# EAGLE schematic timerinsol (EAGLE 6.5.0)
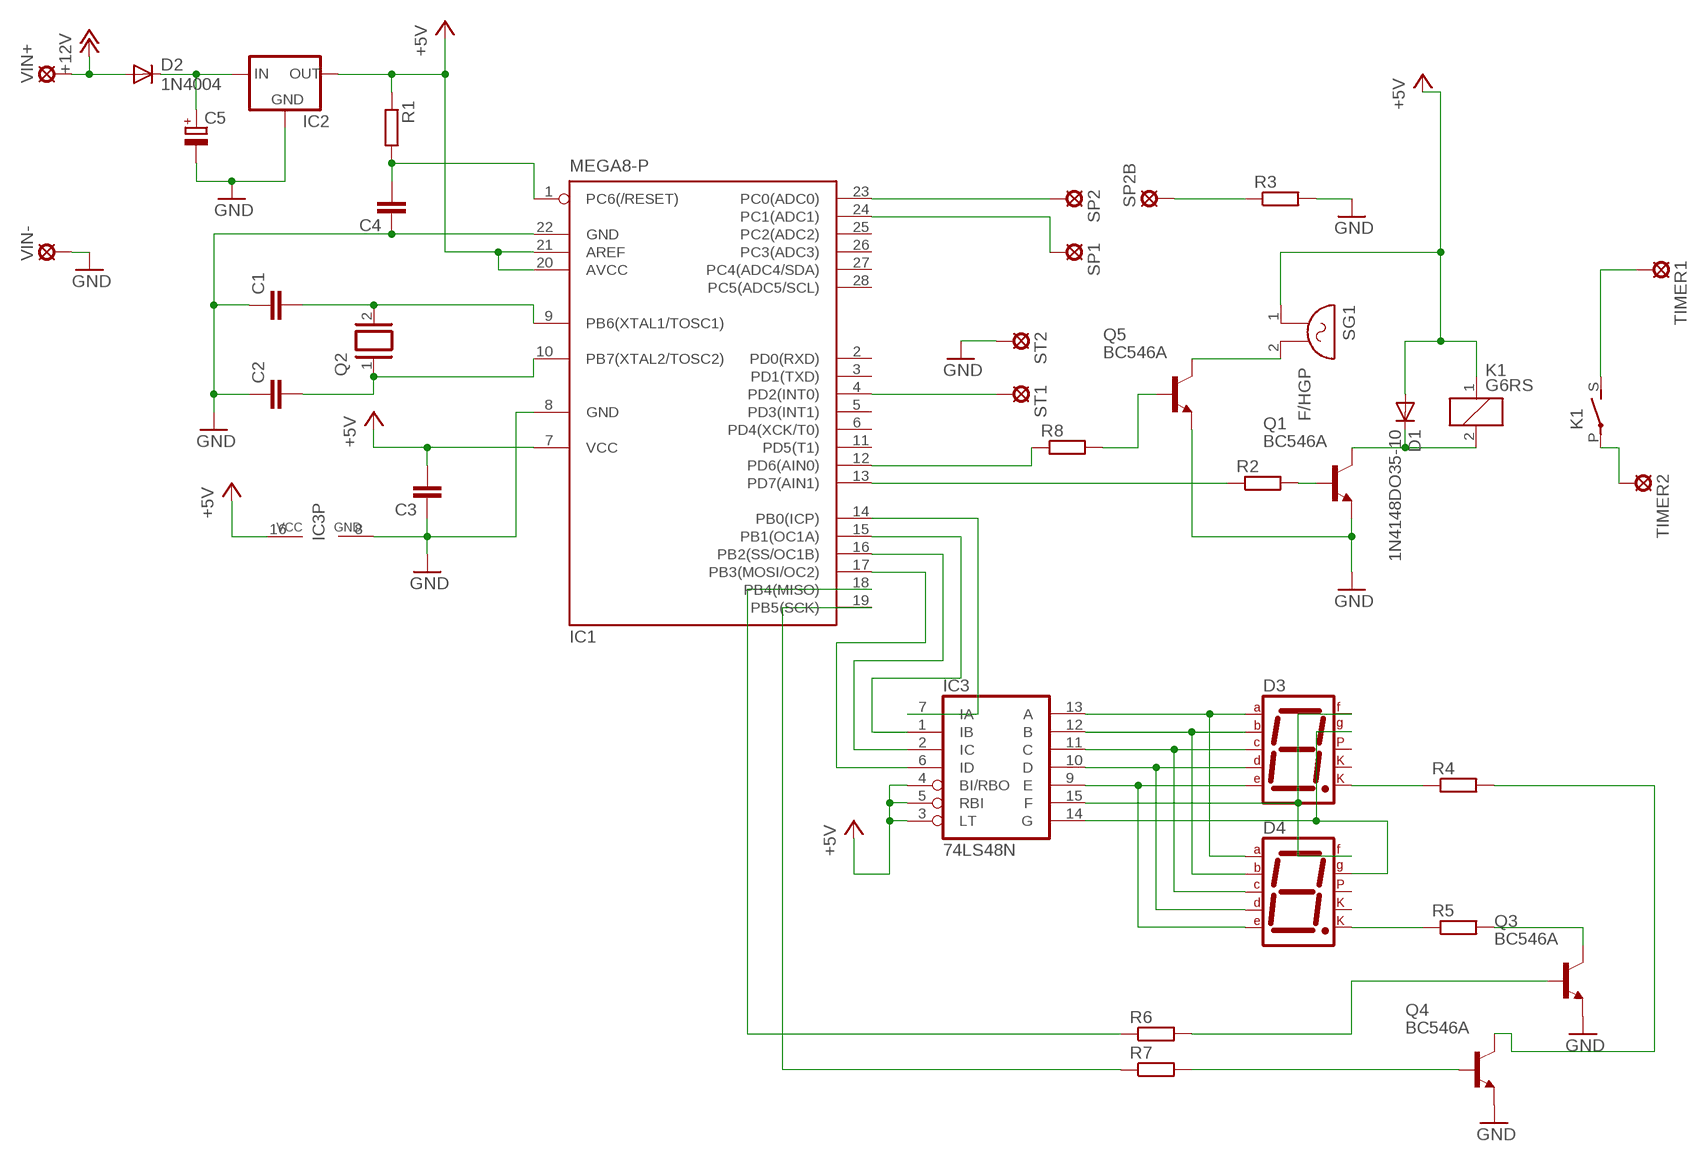
[diagram p0: schematic, sheet 1]

## Parts
C1  C-EU025-025X050  [C025-025X050]
C2  C-EU025-025X050  [C025-025X050]
C3  C-EU025-025X050  [C025-025X050]
C4  C-EU025-025X050  [C025-025X050]
C5  CPOL-EUE2.5-6  [E2,5-6]
D1  1N4148DO35-10  [DO35-10]
D2  1N4004  [DO41-10]
D3  7SEG-CK  [7SEG-13]
D4  7SEG-CK  [7SEG-13]
IC1  MEGA8-P  [DIL28-3]
IC2  78XXS  [78XXS]
IC3  74LS48N  [DIL16]
K1  G6RS  [G6RS]
Q1  BC546A  [TO92-EBC]
Q2  XTAL/S  [QS]
Q3  BC546A  [TO92-EBC]
Q4  BC546A  [TO92-EBC]
Q5  BC546A  [TO92-EBC]
R1  R-EU_0204/7  [0204/7]
R2  R-EU_0207/5V  [0207/5V]
R3  R-EU_0207/5V  [0207/5V]
R4  R-EU_0207/5V  [0207/5V]
R5  R-EU_0207/5V  [0207/5V]
R6  R-EU_0207/5V  [0207/5V]
R7  R-EU_0207/5V  [0207/5V]
R8  R-EU_0207/5V  [0207/5V]
SG1  F/HGP  [F/HGP]
SP1  LSP10  [LSP10]
SP2  LSP10  [LSP10]
SP2B  LSP10  [LSP10]
ST1  LSP10  [LSP10]
ST2  LSP10  [LSP10]
TIMER1  LSP10  [LSP10]
TIMER2  LSP10  [LSP10]
VIN+  LSP10  [LSP10]
VIN-  LSP10  [LSP10]

## Nets
+5V: C3.2 D1.A IC1.7(VCC) IC1.20(AVCC) IC1.21(AREF) IC2.OUT IC3.3(LT) IC3.4(BI/RBO) IC3.5(RBI) IC3.16(VCC) K1.1 R1.1 SG1.1
+12V: D2.A VIN+.MP
GND: C1.1 C2.1 C3.1 C4.1 C5.- IC1.8(GND) IC1.22(GND) IC2.GND IC3.8(GND) Q1.E Q3.E Q4.E Q5.E R3.2 ST2.MP VIN-.MP
N$1: D3.7(A) D4.7(A) IC3.13(A)
N$2: D3.6(B) D4.6(B) IC3.12(B)
N$3: D3.4(C) D4.4(C) IC3.11(C)
N$4: D3.2(D) D4.2(D) IC3.10(D)
N$5: D3.1(E) D4.1(E) IC3.9(E)
N$6: D3.9(F) D4.9(F) IC3.15(F)
N$7: IC1.13(PD7(AIN1)) R2.1
N$8: Q1.B R2.2
N$9: D1.C K1.2 Q1.C
N$10: D3.10(G) D4.10(G) IC3.14(G)
N$11: C1.2 IC1.9(PB6(XTAL1/TOSC1)) Q2.2
N$12: C2.2 IC1.10(PB7(XTAL2/TOSC2)) Q2.1
N$13: IC1.4(PD2(INT0)) ST1.MP
N$14: IC1.14(PB0(ICP)) IC3.7(IA)
N$15: IC1.15(PB1(OC1A)) IC3.1(IB)
N$16: C4.2 IC1.1(PC6(/RESET)) R1.2
N$17: IC1.16(PB2(SS/OC1B)) IC3.2(IC)
N$18: C5.+ D2.C IC2.IN
N$19: IC1.17(PB3(MOSI/OC2)) IC3.6(ID)
N$20: IC1.23(PC0(ADC0)) SP2.MP
N$21: Q4.B R7.2
N$22: IC1.18(PB4(MISO)) R6.1
N$23: IC1.19(PB5(SCK)) R7.1
N$24: Q3.B R6.2
N$25: D4.8(CK2) R5.1
N$26: Q3.C R5.2
N$27: D3.8(CK2) R4.1
N$28: Q4.C R4.2
N$29: IC1.12(PD6(AIN0)) R8.1
N$30: K1.S(2:S) TIMER1.MP
N$31: K1.P(2:P) TIMER2.MP
N$32: Q5.B R8.2
N$33: IC1.24(PC1(ADC1)) SP1.MP
N$34: Q5.C SG1.2
N$35: R3.1 SP2B.MP
Unconnected: D3.3(CK1) D3.5(DP) D4.3(CK1) D4.5(DP) IC1.2(PD0(RXD)) IC1.3(PD1(TXD)) IC1.5(PD3(INT1)) IC1.6(PD4(XCK/T0)) IC1.11(PD5(T1)) IC1.25(PC2(ADC2)) IC1.26(PC3(ADC3)) IC1.27(PC4(ADC4/SDA)) IC1.28(PC5(ADC5/SCL))

## Library data of the parts
C1-C4 = rcl:C-EU: CAPACITOR, European symbol
C5 = rcl:CPOL-EU: POLARIZED CAPACITOR, European symbol
D1 = diode:1N4148: DIODE high speed (Philips)
D2 = diode:1N4004: DIODE general purpose rectifier, 1 A
D3 D4 = special:7SEG-CK: 7-segment DISPLAY single cathode, 13 mm
IC1 = atmel:MEGA8-P: MICROCONTROLLER 8 Kbytes FLASH, 1 kbytes SRAM, 512 bytes EEPROM, USART, 4-channel 10 bit ADC, 2-channel 8 bit ADC Pin compatible with Atmega48, ATMega88, ATMega168 Source: avr.lbr; OC_FARNELL: unknown; OC_NEWARK: unknown
IC2 = v-reg:78XXS: VOLTAGE REGULATOR
IC3 = 74xx-eu:74*48: BCD to seven segment DECODER/DRIVER
K1 = relay:G6RS: RELAY 1 x norm. open, Omron; OC_FARNELL: unknown; OC_NEWARK: unknown
Q1 Q3-Q5 = transistor-npn:BC546*: NPN Transistor
Q2 = special:XTAL/S: CRYSTAL
R1-R8 = rcl:R-EU_: RESISTOR, European symbol
SG1 = buzzer:F/HGP: BUZZER Source: Buerklin; OC_FARNELL: unknown; OC_NEWARK: unknown
SP1 SP2 SP2B ST1 ST2 TIMER1 TIMER2 VIN+ VIN- = solpad:LSP10: SOLDER PAD drill 1.0 mm, distributor Buerklin, 12H555